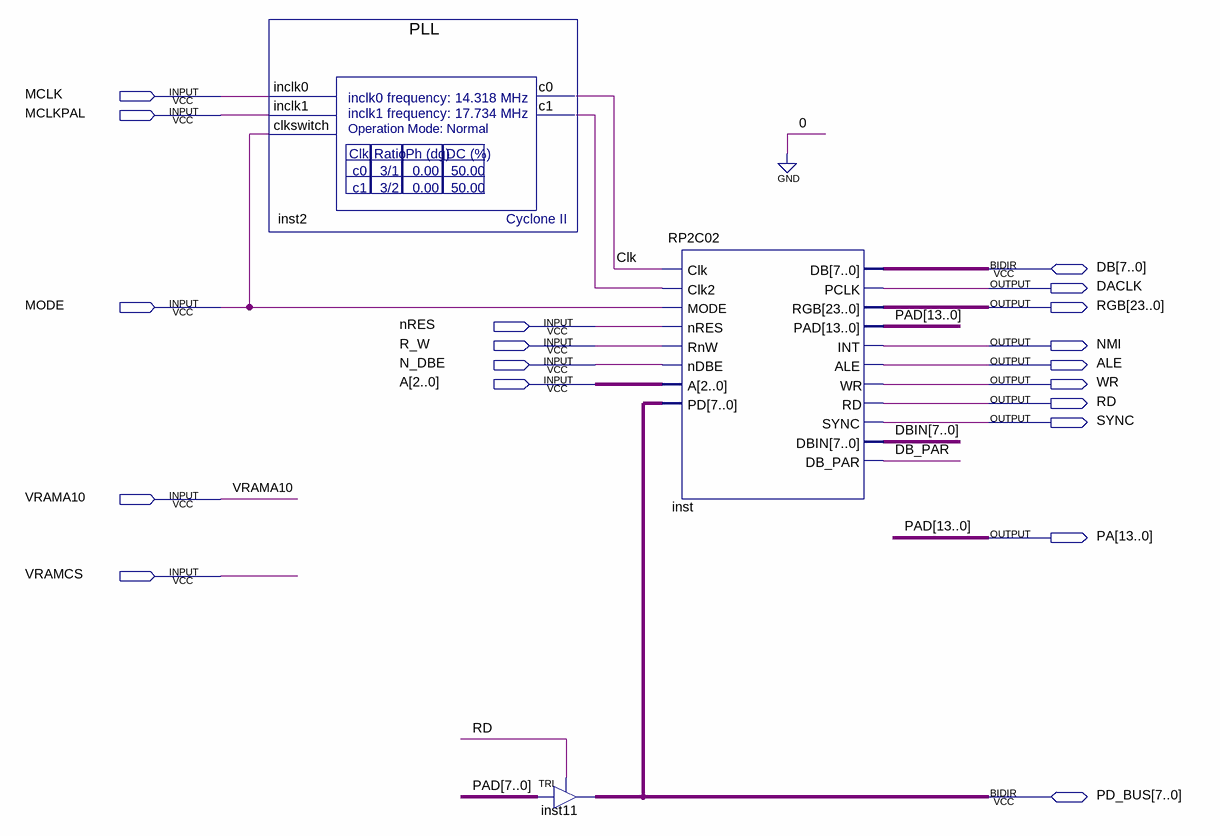
[diagram p0: schematic sheet]
// Quartus schematic V2.bdf as structural Verilog: 3 symbols, 19 pins
module V2 (
  input  MCLK,
  input  MCLKPAL,
  input  MODE,
  input  nRES,
  input  R_W,
  input  N_DBE,
  input  [2:0] A,
  input  VRAMA10,
  input  VRAMCS,
  inout  [7:0] DB,
  inout  [7:0] PD_BUS,
  output DACLK,
  output [23:0] RGB,
  output NMI,
  output ALE,
  output WR,
  output RD,
  output SYNC,
  output [13:0] PA
);

  wire Clk, DB_PAR, inst2_c1;
  wire [7:0] DBIN;

  PLL inst2 (.inclk0(MCLK), .inclk1(MCLKPAL), .clkswitch(MODE), .c0(Clk), .c1(inst2_c1));
  TRI inst11[7:0] (.IN(PA[7:0]), .OE(RD), .OUT(PD_BUS));
  RP2C02 inst (
    .Clk(Clk), .Clk2(inst2_c1), .MODE(MODE), .nRES(nRES), .RnW(R_W), .nDBE(N_DBE), .A(A), .PD(PD_BUS),
    .PCLK(DACLK), .RGB(RGB), .PAD(PA), .INT(NMI), .ALE(ALE), .WR(WR), .RD(RD), .SYNC(SYNC), .DBIN(DBIN),
    .DB_PAR(DB_PAR), .DB(DB));

  // Other names for the same wires on the sheet: PAD[13:0] = PA
endmodule
